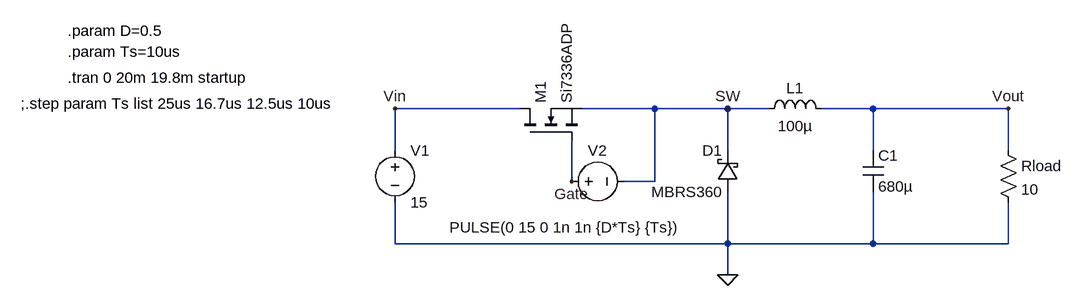
[diagram p0: schematic buck_converter.asc]
buck_converter.asc, the LTspice schematic file:
Version 4
SHEET 1 880 680
WIRE -80 48 -272 48
WIRE 128 48 16 48
WIRE 240 48 128 48
WIRE 304 48 240 48
WIRE 464 48 384 48
WIRE 672 48 464 48
WIRE -272 112 -272 48
WIRE 240 112 240 48
WIRE 464 112 464 48
WIRE 672 112 672 48
WIRE 0 160 0 96
WIRE 128 160 128 48
WIRE 128 160 80 160
WIRE -272 256 -272 192
WIRE 240 256 240 176
WIRE 240 256 -272 256
WIRE 464 256 464 176
WIRE 464 256 240 256
WIRE 672 256 672 192
WIRE 672 256 464 256
WIRE 240 304 240 256
FLAG 240 304 0
FLAG -272 48 Vin
FLAG 672 48 Vout
FLAG 0 160 Gate
FLAG 240 48 SW
SYMBOL voltage -272 96 R0
WINDOW 123 0 0 Left 0
WINDOW 39 0 0 Left 0
SYMATTR InstName V1
SYMATTR Value 15
SYMBOL ind 288 64 R270
WINDOW 0 32 56 VTop 2
WINDOW 3 5 56 VBottom 2
SYMATTR InstName L1
SYMATTR Value 100µ
SYMBOL cap 448 112 R0
SYMATTR InstName C1
SYMATTR Value 680µ
SYMBOL nmos -80 96 R270
SYMATTR InstName M1
SYMATTR Value Si7336ADP
SYMBOL schottky 256 176 R180
WINDOW 0 24 64 Left 2
WINDOW 3 24 0 Left 2
SYMATTR InstName D1
SYMATTR Value MBRS360
SYMATTR Description Diode
SYMATTR Type diode
SYMBOL res 656 96 R0
SYMATTR InstName Rload
SYMATTR Value 10
SYMBOL voltage -16 160 R270
WINDOW 0 32 56 VTop 2
WINDOW 3 -55 6 VBottom 2
WINDOW 123 0 0 Left 0
WINDOW 39 0 0 Left 0
SYMATTR InstName V2
SYMATTR Value PULSE(0 15 0 1n 1n {D*Ts} {Ts})
TEXT -776 0 Left 2 !.tran 0 20m 19.8m startup
TEXT -776 -72 Left 2 !.param D=0.5
TEXT -776 -40 Left 2 !.param Ts=10us
TEXT -848 40 Left 2 !;.step param Ts list 25us 16.7us 12.5us 10us

The netlist it stands for:
* buck_converter.asc
V1 Vin 0 15
L1 SW Vout 100µ
C1 Vout 0 680µ
M1 Vin Gate SW SW Si7336ADP
D1 0 SW MBRS360
Rload Vout 0 10
V2 Gate SW PULSE(0 15 0 1n 1n {D*Ts} {Ts})
.model D D
.lib standard.dio
.model NMOS NMOS
.model PMOS PMOS
.lib standard.mos
.tran 0 20m 19.8m startup
.param D=0.5
.param Ts=10us
;.step param Ts list 25us 16.7us 12.5us 10us
.backanno
.end